# EAGLE design switch (EAGLE 9.1.3)
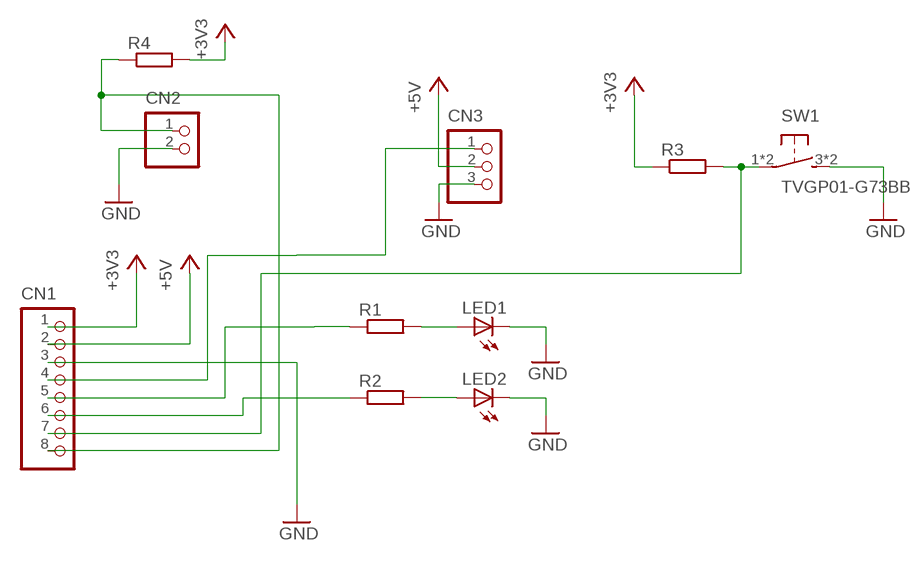
[diagram p0: schematic, sheet 1]

## Parts
CN1  B8B-PH-K-S  [B8B-PH-K-S]
CN2  B2B-PH-K-S  [B2B-PH-K-S]
CN3  B3B-PH-K-S  [B3B-PH-K-S]
LED1  LED5MM  [LED5MM]
LED2  LED5MM  [LED5MM]
R1  R-EU_0204/7  [0204/7]
R2  R-EU_0204/7  [0204/7]
R3  R-EU_0204/7  [0204/7]
R4  R-EU_0204/7  [0204/7]
SW1  TVGP01-G73BB  [TVGP01-G73BB]

## Nets
+3V3 [Power]: CN1.1 R3.1 R4.2
+5V [Power]: CN1.2 CN3.2
GND [Power]: CN1.3 CN2.2 CN3.3 LED1.K(C) LED2.K(C) SW1.3 SW1.4
N$1: LED1.A R1.2
N$2: LED2.A R2.2
N$3: CN1.6 R2.1
N$4: CN1.5 R1.1
N$5: CN1.7 R3.2 SW1.1 SW1.2
N$6: CN1.8 CN2.1 R4.1
N$8: CN1.4 CN3.1

## Library data of the parts
CN1 = jst-ph:B8B-PH-*: Wire-to-Board 2.0mm pitch top mount connector Source: http://www.jst-mfg.com/product/pdf/jpn/PH.pdf http://www.jst-mfg.com/product/detail.php?series=199
CN2 = jst-ph:B2B-PH-*: Wire-to-Board 2.0mm pitch top mount connector Source: http://www.jst-mfg.com/product/pdf/jpn/PH.pdf http://www.jst-mfg.com/product/detail.php?series=199
CN3 = jst-ph:B3B-PH-*: Wire-to-Board 2.0mm pitch top mount connector Source: http://www.jst-mfg.com/product/pdf/jpn/PH.pdf http://www.jst-mfg.com/product/detail.php?series=199
LED1 LED2 = 180118 Library by matsu:LED: LED OSRAM: - CHIPLED LG R971, LG N971, LY N971, LG Q971, LY Q971, LO R971, LY R971 LH N974, LH R974 LS Q976, LO Q976, LY Q976 LO Q996 - Hyper CHIPLED LW Q18S LB Q993, LB Q99A, LB R99A - SideLED LS A670, LO A670, LY A670, LG A670, LP A670 LB A673, LV A673, LT A673, LW A673 LH A674 LY A675 LS A676, LA A676, LO A676, LY A676, LW A676 LS A679, LY A679, LG A679 - Hyper Micro SIDELED® LS Y876, LA Y876, LO Y876, LY Y876 LT Y87S - SmartLED LW L88C, LW L88S LB L89C, LB L89S, LG L890 LS L89K, LO L89K, LY L89K LS L896, LA L896, LO L896, LY L896 - TOPLED LS T670, LO T670, LY T670, LG T670, LP T670 LSG T670, LSP T670, LSY T670, LOP T670, LYG T670 LG T671, LOG T671, LSG T671 LB T673, LV T673, LT T673, LW T673 LH T674 LS T676, LA T676, LO T676, LY T676, LB T676, LH T676, LSB T676, LW T676 LB T67C, LV T67C, LT T67C, LS T67K, LO T67K, LY T67K, LW E67C LS E67B, LA E67B, LO E67B, LY E67B, LB E67C, LV E67C, LT E67C LW T67C LS T679, LY T679, LG T679 LS T770, LO T770, LY T770, LG T770, LP T770 LB T773, LV T773, LT T773, LW T773 LH T774 LS E675, LA E675, LY E675, LS T675 LS T776, LA T776, LO T776, LY T776, LB T776 LHGB T686 LT T68C, LB T68C - Hyper Mini TOPLED® LB M676 - Mini TOPLED Santana® LG M470 LS M47K, LO M47K, LY M47K Source: http://www.osram.convergy.de LUXEON: - LUMILED® LXK2-PW12-R00, LXK2-PW12-S00, LXK2-PW14-U00, LXK2-PW14-V00 LXK2-PM12-R00, LXK2-PM12-S00, LXK2-PM14-U00 LXK2-PE12-Q00, LXK2-PE12-R00, LXK2-PE12-S00, LXK2-PE14-T00, LXK2-PE14-U00 LXK2-PB12-K00, LXK2-PB12-L00, LXK2-PB12-M00, LXK2-PB14-N00, LXK2-PB14-P00, LXK2-PB14-Q00 LXK2-PR12-L00, LXK2-PR12-M00, LXK2-PR14-Q00, LXK2-PR14-R00 LXK2-PD12-Q00, LXK2-PD12-R00, LXK2-PD12-S00 LXK2-PH12-R00, LXK2-PH12-S00 LXK2-PL12-P00, LXK2-PL12-Q00, LXK2-PL12-R00 Source: www.luxeon.com KINGBRIGHT: KA-3528ASYC Source: www.kingbright.com
R1-R4 = 180118 Library by matsu:R-EU_: RESISTOR, European symbol
SW1 = TVGP01-G73BB:TVGP01-G73BB: http://akizukidenshi.com/download/ds/jianfu/TVGP01-G73BB.pdf

## Net classes
0 default: width 0.508 mm
1 Power: width 1.016 mm

## Board
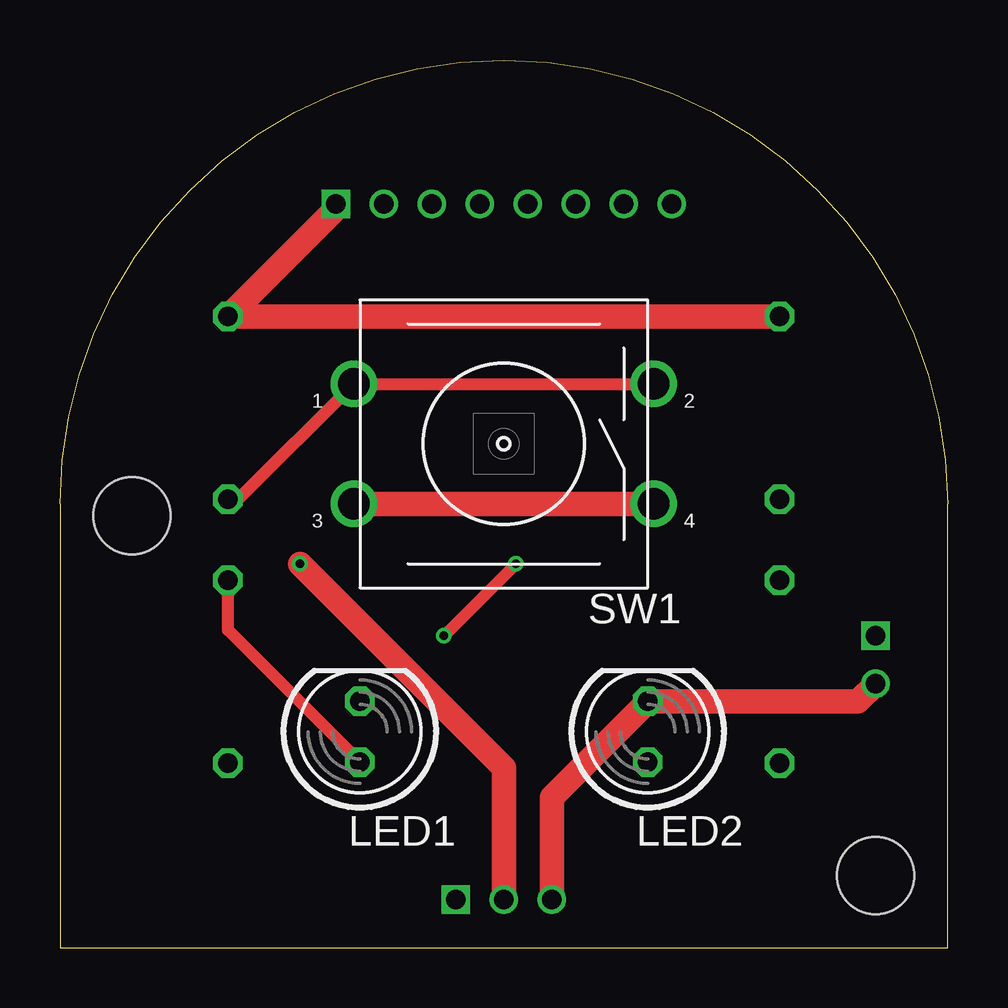
[diagram p1: board, top side]
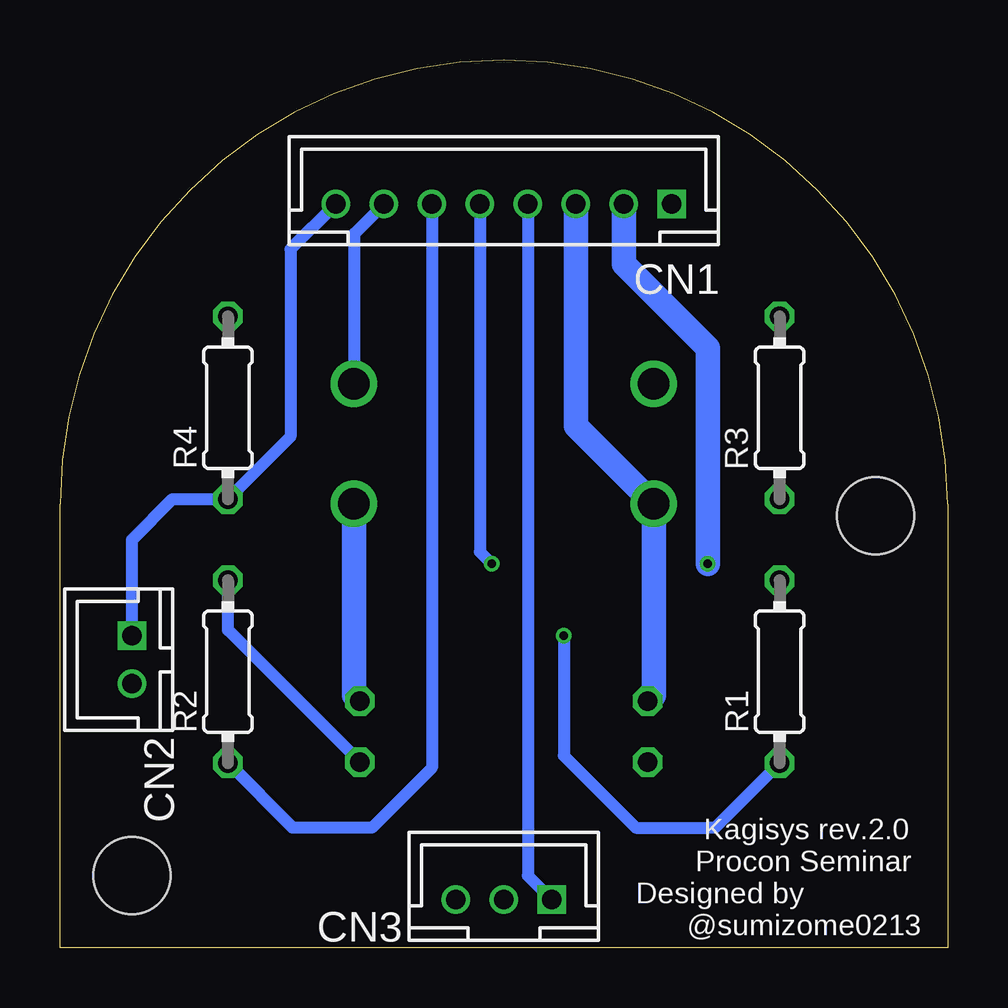
[diagram p2: board, bottom side, seen from below]

Size 37 x 37 mm. Coordinates in mm from the lower left corner, seen from the top.
Outline: 0,0 14,0 23,0 37,0 37,18.5 arc180 0,18.5 0,0
Copper layers (1*16): Top 0.035mm / dielectric 1.6mm / Bottom 0.035mm
Design rules "Elecrow_2-layer_PCB_eagle_rule": minimum track width 6mil, minimum drill 12mil, track to track 6mil, track to pad 8mil, pad to pad 12mil, via to via 12mil, smd to smd 0mil, copper to edge 20mil, drill to drill 10mil, minimum pad ring 6mil, minimum via ring 6mil, stop-mask expansion 0mil, vias tented up to drill 100mil, thermal gap 10mil
Holes 3.2 mm at 3,18 34,3

### Footprints (pad centres in the part's own frame; a part is rotated, then mirrored left to right if it is on the bottom)
B8B-PH-K-S = drill 0.8 square: 1 -7,0 | drill 0.8: 2 -5,0; 3 -3,0; 4 -1,0; 5 1,0; 6 3,0; 7 5,0; 8 7,0
B2B-PH-K-S = drill 0.8 square: 1 -1,0 | drill 0.8: 2 1,0
B3B-PH-K-S = drill 0.8 square: 1 -2,0 | drill 0.8: 2 0,0; 3 2,0
LED5MM = drill 0.813 octagon: A -1.27,0; K 1.27,0
0204/7 = drill 0.813 octagon: 1 -3.81,0; 2 3.81,0
TVGP01-G73BB = drill 1.3: 1 -6.25,2.5; 2 6.25,2.5; 3 -6.25,-2.5; 4 6.25,-2.5

### Placement (x,y rotation side)
CN1  18.5,31 180 bottom
CN2  34,12 270 bottom
CN3  18.5,2 180 bottom
LED1  12.5,9 90 top
LED2  24.5,9 90 top
R1  7,11.5 90 bottom
R2  30,11.5 90 bottom
R3  7,22.5 270 bottom
R4  30,22.5 90 bottom
SW1  18.5,21 0 top

### Tracks (layer width: path | path; a pad name or v marks a point on that pad's centre or on a via)
+3V3
  Top 1.016: R4.2 R3.1 11.5,30.81 CN1.1
+5V  (via drill 0.35)
  Top 1.016: v10,16 18.5,7.5 CN3.2
  Bottom 1.016: v10,16 10,25 13.5,28.5 CN1.2
GND
  Top 1.016: SW1.3 SW1.4 | CN2.2 33.27,10.27 LED2.K 20.5,6.27 CN3.3
  Bottom 1.016: LED1.K 12.25,10.52 SW1.3 15.5,21.75 CN1.3 | SW1.4 24.75,10.52 LED2.K
N$1
  Top 0.508: LED1.A 7,13.23 R1.2
N$2
  Bottom 0.508: LED2.A 30,13.23 R2.2
N$3
  Bottom 0.508: R2.1 27.31,5 24,5 21.5,7.5 CN1.6
N$4  (via drill 0.35)
  Top 0.508: v19,16 v16,13
  Bottom 0.508: R1.1 9.69,5 10,5 13,5 16,8 v16,13 | CN1.5 19.5,16.5 v19,16
N$5
  Top 0.508: SW1.2 SW1.1 7.44,18.69 R3.2
  Bottom 0.508: CN1.7 24.75,29.75 SW1.2
N$6
  Bottom 0.508: CN2.1 34,17 32.31,18.69 R4.1 27.39,21.3 27.39,29.11 CN1.8
N$8
  Bottom 0.508: CN1.4 17.5,3 CN3.1

### Text on the board
bPlace: Kagisys rev.2.0 / Procon Seminar / Designed by / @sumizome0213